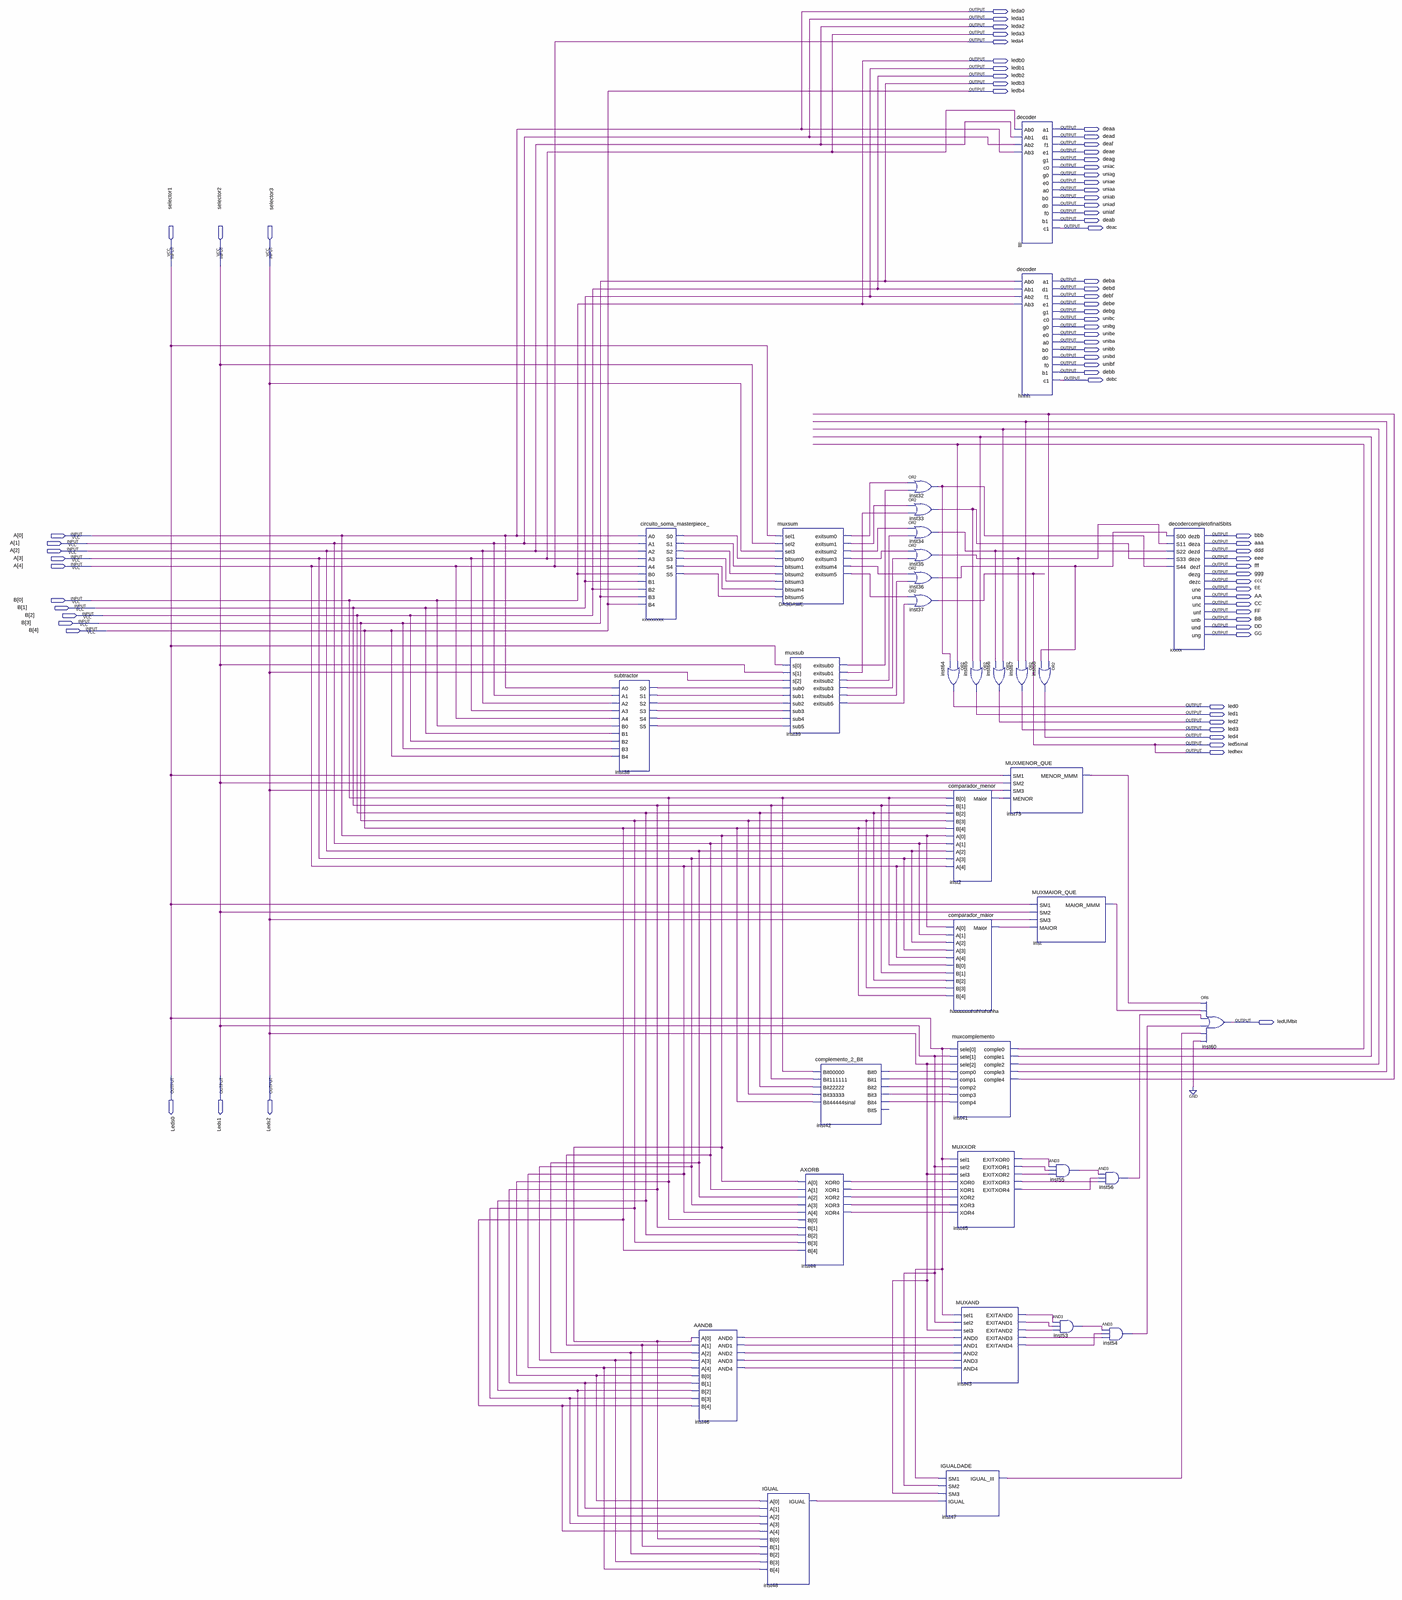
[diagram p0: schematic sheet, whole]
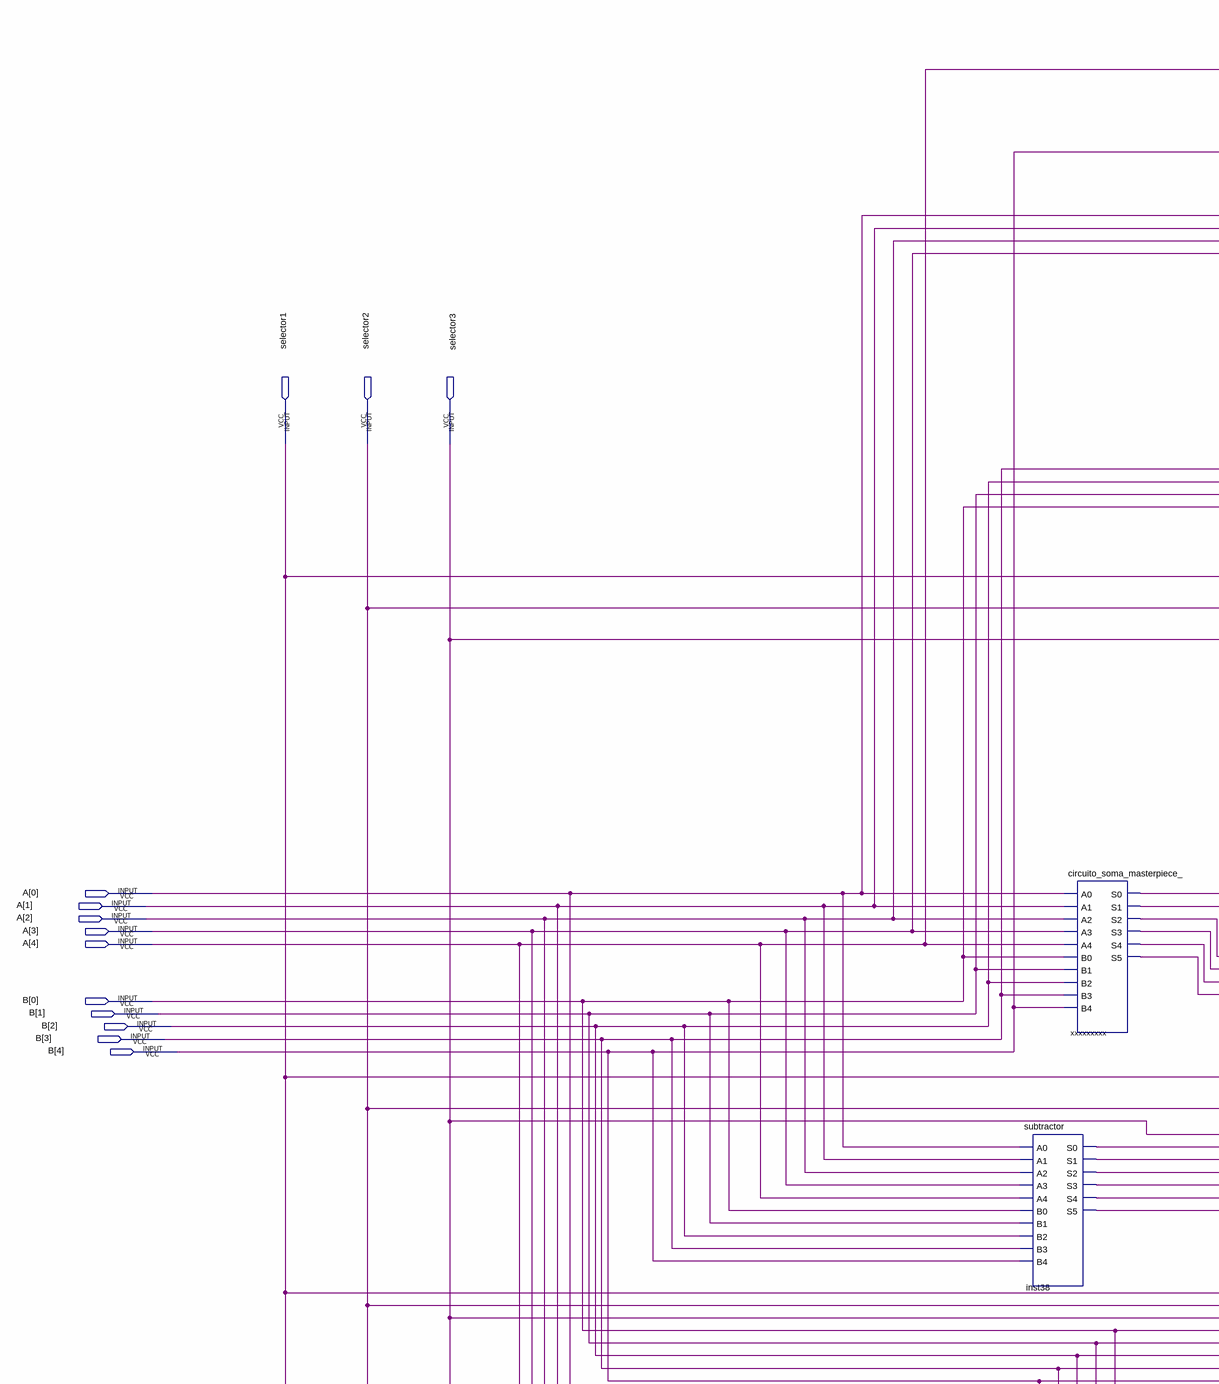
[diagram p1: schematic sheet, upper left part]
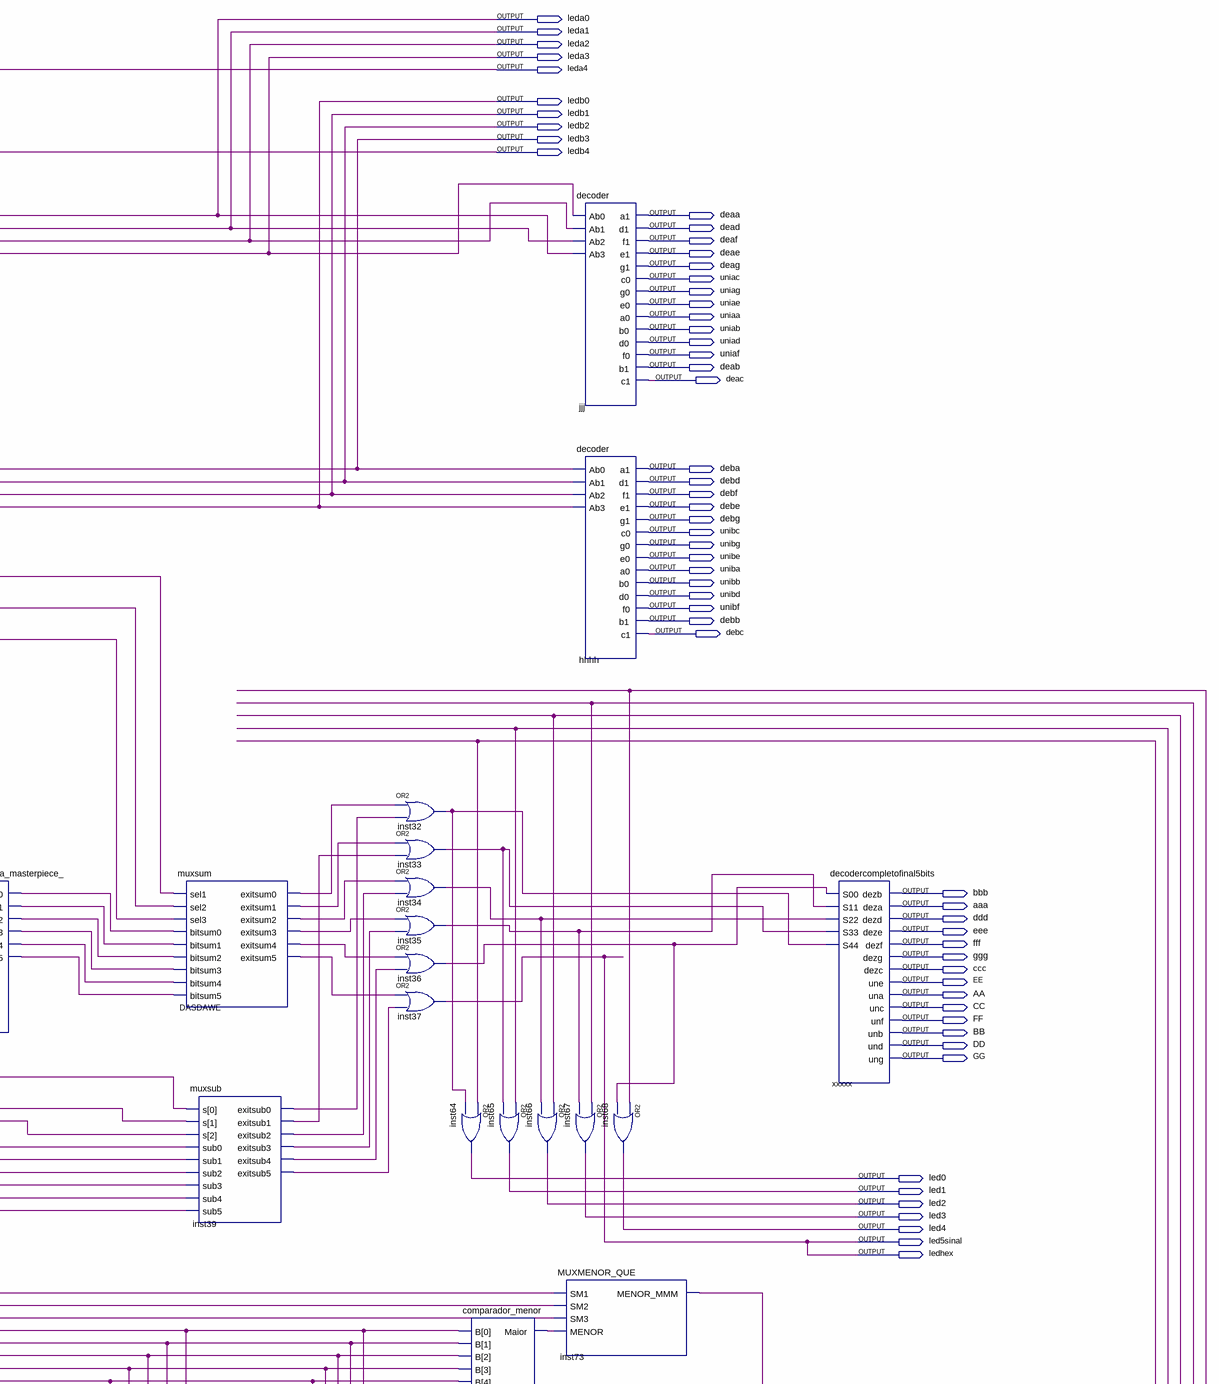
[diagram p2: schematic sheet, upper right part]
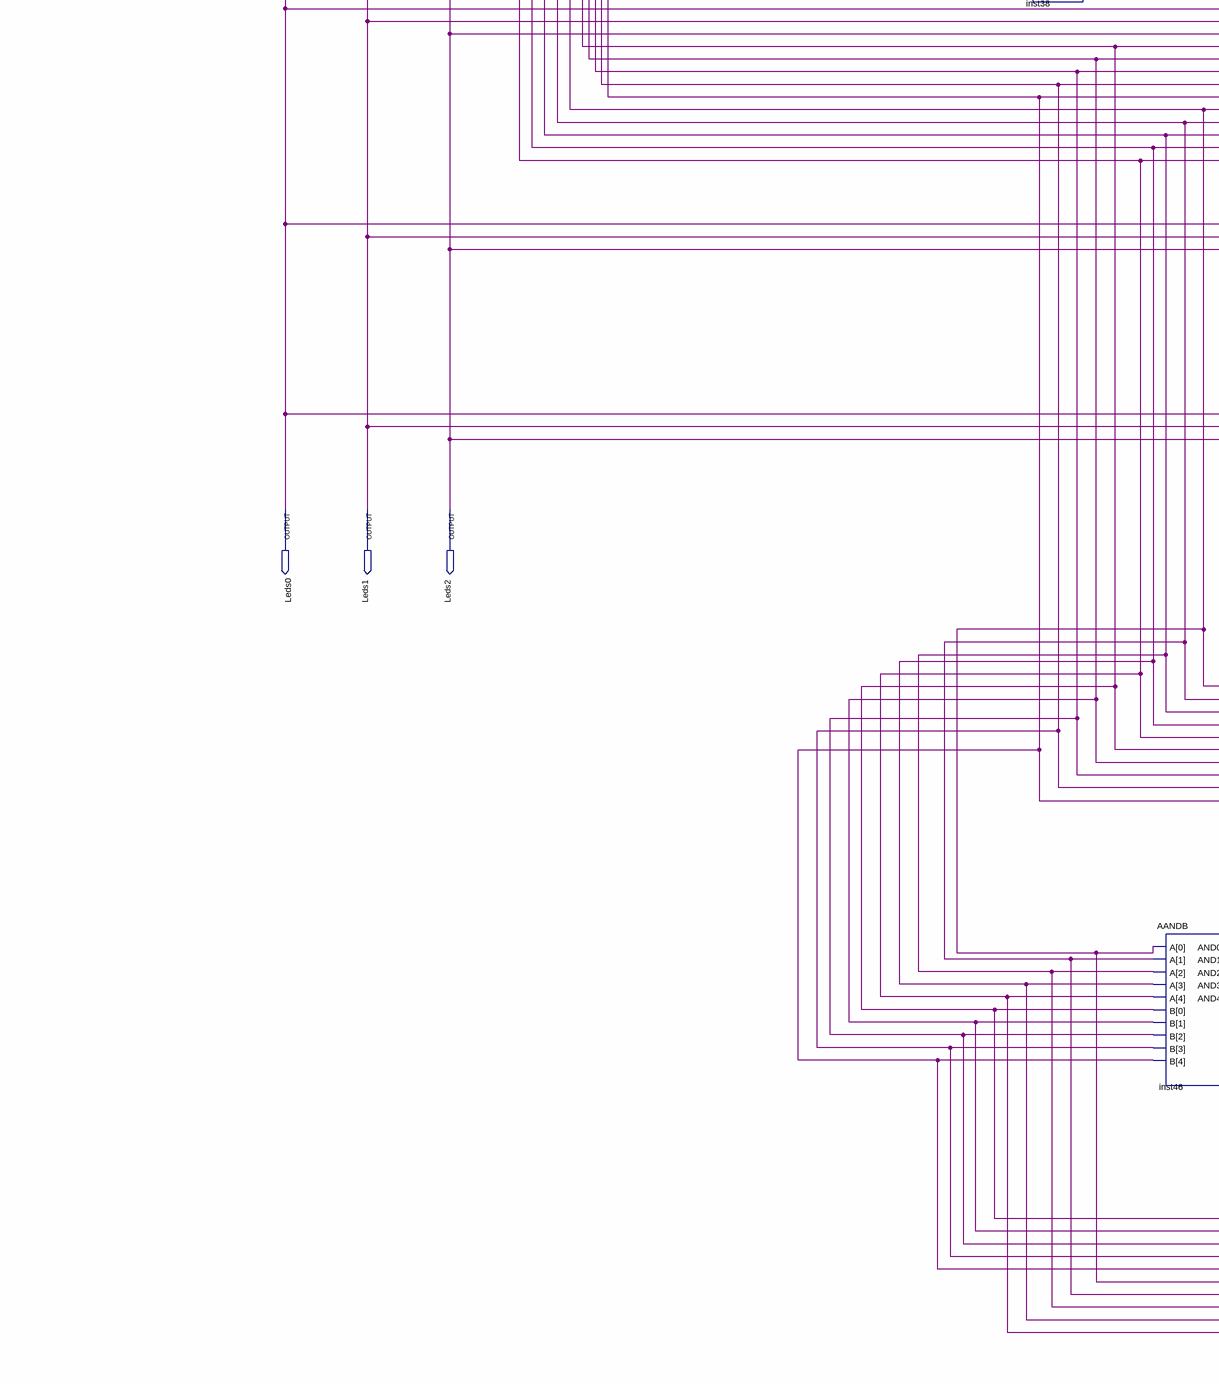
[diagram p3: schematic sheet, lower left part]
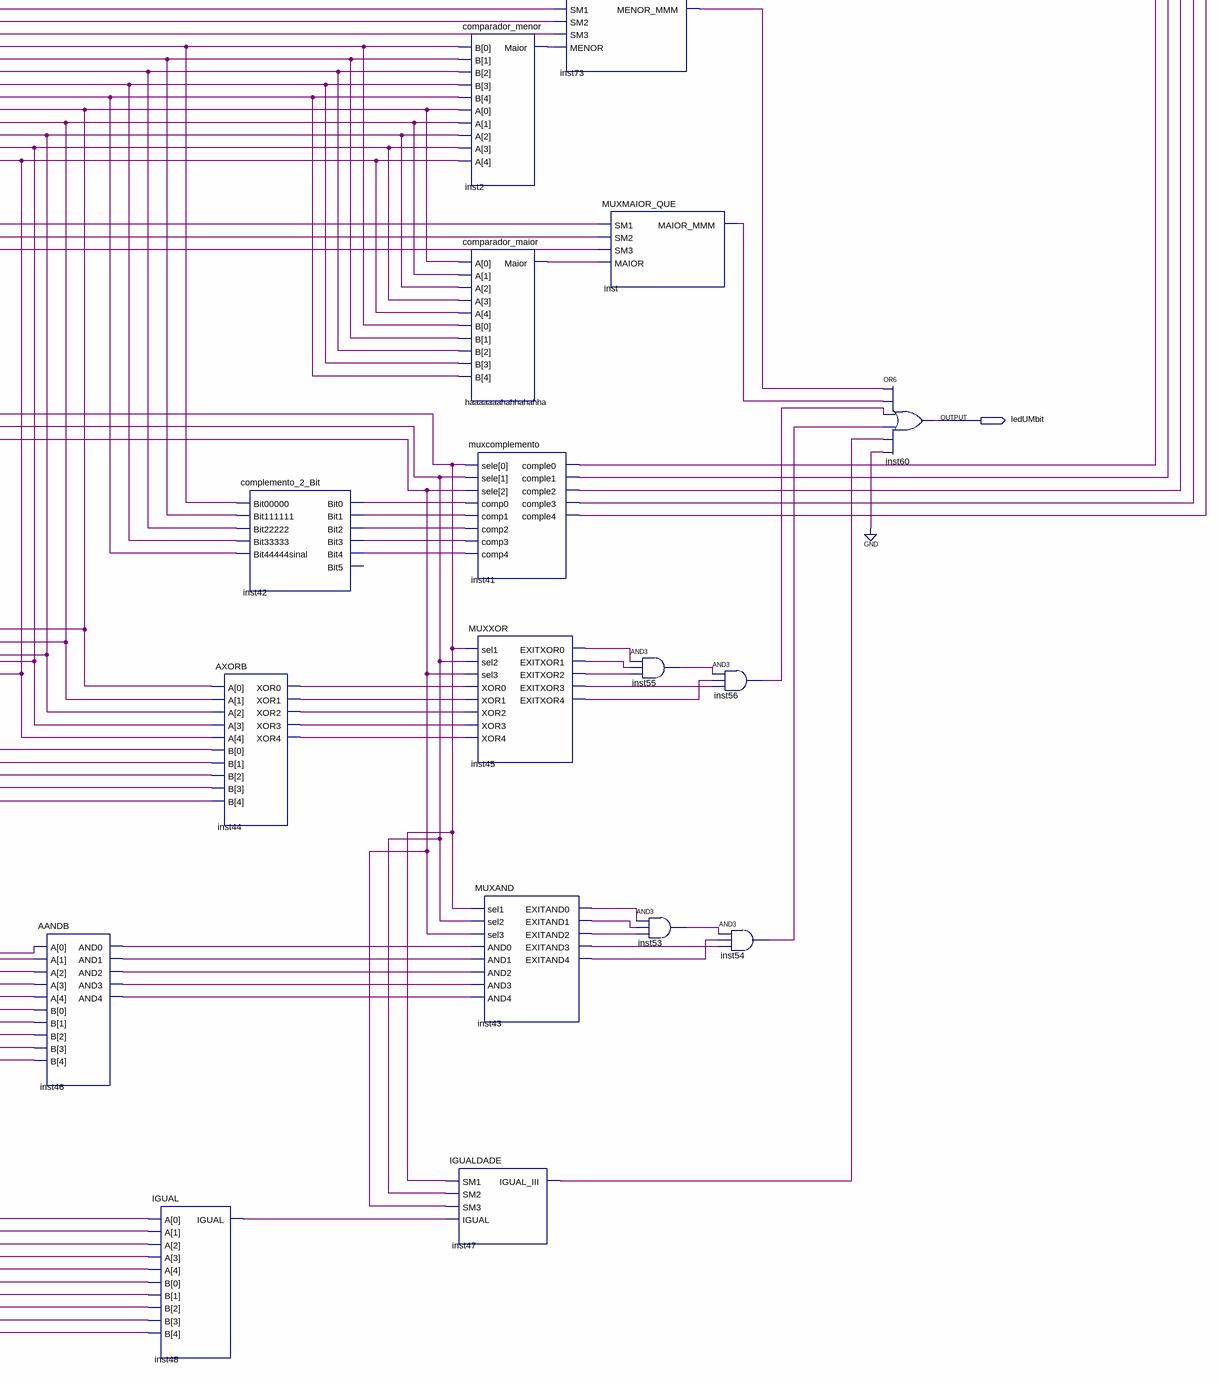
[diagram p4: schematic sheet, lower right part]
// Quartus schematic circuito_completo.bdf as structural Verilog: 35 symbols, 76 pins
module circuito_completo (
  input  selector1,
  input  selector2,
  input  selector3,
  input  [4:0] A,
  input  [4:0] B,
  output leda0,
  output leda1,
  output leda2,
  output leda3,
  output leda4,
  output ledb0,
  output ledb1,
  output ledb2,
  output ledb3,
  output ledb4,
  output deaa,
  output dead,
  output deaf,
  output deae,
  output deag,
  output uniac,
  output uniag,
  output uniae,
  output uniaa,
  output uniab,
  output uniad,
  output uniaf,
  output deab,
  output deac,
  output deba,
  output debd,
  output debf,
  output debe,
  output debg,
  output unibc,
  output unibg,
  output unibe,
  output uniba,
  output unibb,
  output unibd,
  output unibf,
  output debb,
  output debc,
  output bbb,
  output aaa,
  output ddd,
  output eee,
  output fff,
  output ggg,
  output ccc,
  output EE,
  output AA,
  output CC,
  output FF,
  output BB,
  output DD,
  output GG,
  output led0,
  output led1,
  output led2,
  output led3,
  output led4,
  output led5sinal,
  output ledhex,
  output ledUMbit,
  output Leds0,
  output Leds1,
  output Leds2
);

  wire DASDAWE_exitsum0, DASDAWE_exitsum1, DASDAWE_exitsum2, DASDAWE_exitsum3, DASDAWE_exitsum4,
       DASDAWE_exitsum5, haaaaaaahahhahahha_maior, inst2_maior, inst32_out, inst33_out, inst34_out,
       inst35_out, inst36_out, inst38_s0, inst38_s1, inst38_s2, inst38_s3, inst38_s4, inst38_s5,
       inst39_exitsub0, inst39_exitsub1, inst39_exitsub2, inst39_exitsub3, inst39_exitsub4, inst39_exitsub5,
       inst41_comple0, inst41_comple1, inst41_comple2, inst41_comple3, inst41_comple4, inst42_bit0,
       inst42_bit1, inst42_bit2, inst42_bit3, inst42_bit4, inst43_exitand0, inst43_exitand1, inst43_exitand2,
       inst43_exitand3, inst43_exitand4, inst44_xor0, inst44_xor1, inst44_xor2, inst44_xor3, inst44_xor4,
       inst45_exitxor0, inst45_exitxor1, inst45_exitxor2, inst45_exitxor3, inst45_exitxor4, inst46_and0,
       inst46_and1, inst46_and2, inst46_and3, inst46_and4, inst47_igual_iii, inst48_igual, inst53_out,
       inst54_out, inst55_out, inst56_out, inst73_menor_mmm, inst_maior_mmm, xxxxxxxxx_s0, xxxxxxxxx_s1,
       xxxxxxxxx_s2, xxxxxxxxx_s3, xxxxxxxxx_s4, xxxxxxxxx_s5;

  subtractor inst38 (
    .A0(A[0]), .A1(A[1]), .A2(A[2]), .A3(A[3]), .A4(A[4]), .B0(B[0]), .B1(B[1]), .B2(B[2]), .B3(B[3]),
    .B4(B[4]), .S0(inst38_s0), .S1(inst38_s1), .S2(inst38_s2), .S3(inst38_s3), .S4(inst38_s4), .S5(inst38_s5));
  circuito_soma_masterpiece_ xxxxxxxxx (
    .A0(A[0]), .A1(A[1]), .A2(A[2]), .A3(A[3]), .A4(A[4]), .B0(B[0]), .B1(B[1]), .B2(B[2]), .B3(B[3]),
    .B4(B[4]), .S0(xxxxxxxxx_s0), .S1(xxxxxxxxx_s1), .S2(xxxxxxxxx_s2), .S3(xxxxxxxxx_s3), .S4(xxxxxxxxx_s4),
    .S5(xxxxxxxxx_s5));
  AANDB inst46 (
    .A(A), .B(B), .AND0(inst46_and0), .AND1(inst46_and1), .AND2(inst46_and2), .AND3(inst46_and3),
    .AND4(inst46_and4));
  muxsum DASDAWE (
    .sel1(selector1), .sel2(selector2), .sel3(selector3), .bitsum0(xxxxxxxxx_s0), .bitsum1(xxxxxxxxx_s1),
    .bitsum2(xxxxxxxxx_s2), .bitsum3(xxxxxxxxx_s3), .bitsum4(xxxxxxxxx_s4), .bitsum5(xxxxxxxxx_s5),
    .exitsum0(DASDAWE_exitsum0), .exitsum1(DASDAWE_exitsum1), .exitsum2(DASDAWE_exitsum2),
    .exitsum3(DASDAWE_exitsum3), .exitsum4(DASDAWE_exitsum4), .exitsum5(DASDAWE_exitsum5));
  muxsub inst39 (
    .s({selector3, selector2, selector1}), .sub0(inst38_s0), .sub1(inst38_s1), .sub2(inst38_s2),
    .sub3(inst38_s3), .sub4(inst38_s4), .sub5(inst38_s5), .exitsub0(inst39_exitsub0),
    .exitsub1(inst39_exitsub1), .exitsub2(inst39_exitsub2), .exitsub3(inst39_exitsub3),
    .exitsub4(inst39_exitsub4), .exitsub5(inst39_exitsub5));
  IGUAL inst48 (.A(B), .B(A), .IGUAL(inst48_igual));
  complemento_2_Bit inst42 (
    .Bit00000(B[0]), .Bit111111(B[1]), .Bit22222(B[2]), .Bit33333(B[3]), .Bit44444sinal(B[4]),
    .Bit0(inst42_bit0), .Bit1(inst42_bit1), .Bit2(inst42_bit2), .Bit3(inst42_bit3), .Bit4(inst42_bit4));  // open: Bit5
  AXORB inst44 (
    .A(A), .B(B), .XOR0(inst44_xor0), .XOR1(inst44_xor1), .XOR2(inst44_xor2), .XOR3(inst44_xor3),
    .XOR4(inst44_xor4));
  or inst32 (inst32_out, DASDAWE_exitsum0, inst39_exitsub0);
  or inst33 (inst33_out, DASDAWE_exitsum1, inst39_exitsub1);
  or inst34 (inst34_out, DASDAWE_exitsum2, inst39_exitsub2);
  or inst35 (inst35_out, DASDAWE_exitsum3, inst39_exitsub3);
  or inst36 (inst36_out, DASDAWE_exitsum4, inst39_exitsub4);
  or inst37 (led5sinal, DASDAWE_exitsum5, inst39_exitsub5);
  or inst64 (led0, inst41_comple0, inst32_out);
  or inst65 (led1, inst41_comple1, inst33_out);
  comparador_menor inst2 (.B(B), .A(A), .Maior(inst2_maior));
  comparador_maior haaaaaaahahhahahha (.A(A), .B(B), .Maior(haaaaaaahahhahahha_maior));
  muxcomplemento inst41 (
    .sele({selector3, selector2, selector1}), .comp0(inst42_bit0), .comp1(inst42_bit1), .comp2(inst42_bit2),
    .comp3(inst42_bit3), .comp4(inst42_bit4), .comple0(inst41_comple0), .comple1(inst41_comple1),
    .comple2(inst41_comple2), .comple3(inst41_comple3), .comple4(inst41_comple4));
  MUXXOR inst45 (
    .sel1(selector1), .sel2(selector2), .sel3(selector3), .XOR0(inst44_xor0), .XOR1(inst44_xor1),
    .XOR2(inst44_xor2), .XOR3(inst44_xor3), .XOR4(inst44_xor4), .EXITXOR0(inst45_exitxor0),
    .EXITXOR1(inst45_exitxor1), .EXITXOR2(inst45_exitxor2), .EXITXOR3(inst45_exitxor3),
    .EXITXOR4(inst45_exitxor4));
  MUXAND inst43 (
    .sel1(selector1), .sel2(selector2), .sel3(selector3), .AND0(inst46_and0), .AND1(inst46_and1),
    .AND2(inst46_and2), .AND3(inst46_and3), .AND4(inst46_and4), .EXITAND0(inst43_exitand0),
    .EXITAND1(inst43_exitand1), .EXITAND2(inst43_exitand2), .EXITAND3(inst43_exitand3),
    .EXITAND4(inst43_exitand4));
  IGUALDADE inst47 (
    .SM1(selector1), .SM2(selector2), .SM3(selector3), .IGUAL(inst48_igual), .IGUAL_III(inst47_igual_iii));
  or inst66 (led2, inst41_comple2, inst34_out);
  decoder jjj (
    .Ab0(A[3]), .Ab1(A[2]), .Ab2(A[1]), .Ab3(A[0]), .a1(deaa), .d1(dead), .f1(deaf), .e1(deae), .g1(deag),
    .c0(uniac), .g0(uniag), .e0(uniae), .a0(uniaa), .b0(uniab), .d0(uniad), .f0(uniaf), .b1(deab), .c1(deac));
  decoder hhhh (
    .Ab0(B[3]), .Ab1(B[2]), .Ab2(B[1]), .Ab3(B[0]), .a1(deba), .d1(debd), .f1(debf), .e1(debe), .g1(debg),
    .c0(unibc), .g0(unibg), .e0(unibe), .a0(uniba), .b0(unibb), .d0(unibd), .f0(unibf), .b1(debb), .c1(debc));
  or inst67 (led3, inst41_comple3, inst35_out);
  MUXMENOR_QUE inst73 (
    .SM1(selector1), .SM2(selector2), .SM3(selector3), .MENOR(inst2_maior), .MENOR_MMM(inst73_menor_mmm));
  or inst68 (led4, inst41_comple4, inst36_out);
  MUXMAIOR_QUE inst (
    .SM1(selector1), .SM2(selector2), .SM3(selector3), .MAIOR(haaaaaaahahhahahha_maior),
    .MAIOR_MMM(inst_maior_mmm));
  and inst55 (inst55_out, inst45_exitxor0, inst45_exitxor1, inst45_exitxor2);
  and inst53 (inst53_out, inst43_exitand0, inst43_exitand1, inst43_exitand2);
  and inst56 (inst56_out, inst55_out, inst45_exitxor4, inst45_exitxor3);
  and inst54 (inst54_out, inst53_out, inst43_exitand4, inst43_exitand3);
  decodercompletofinal5bits xxxxx (
    .S00(inst36_out), .S11(inst35_out), .S22(inst34_out), .S33(inst33_out), .S44(inst32_out), .dezb(bbb),
    .deza(aaa), .dezd(ddd), .deze(eee), .dezf(fff), .dezg(ggg), .dezc(ccc), .une(EE), .una(AA), .unc(CC),
    .unf(FF), .unb(BB), .und(DD), .ung(GG));
  or inst60 (ledUMbit, inst73_menor_mmm, inst_maior_mmm, inst56_out, inst54_out, inst47_igual_iii, 1'b0);

  assign leda0 = A[0];
  assign leda1 = A[1];
  assign leda2 = A[2];
  assign leda3 = A[3];
  assign leda4 = A[4];
  assign ledb0 = B[0];
  assign ledb1 = B[1];
  assign ledb2 = B[2];
  assign ledb3 = B[3];
  assign ledb4 = B[4];
  assign ledhex = led5sinal;
  assign Leds0 = selector1;
  assign Leds1 = selector2;
  assign Leds2 = selector3;
endmodule
